# Altium schematic sheet 10. TF Card.SchDoc
size A4; CheckedBy: 黄钦宁; Author: 陈坤; DocumentNumber: 10; SheetNumber: 10; SheetTotal: 13; PageSetup: Record=PageOptions|CenterHorizontal=True|CenterVertical=True|PrintScale=1.00|XCorrection=1.00|YCorrection=1.00|PrintKind=0|BorderSize=5000000|LeftOffset=0|BottomOffset=0|Orientation=2|PaperLength=1000|PaperWidth=1000|Scale=100|PaperSource=7|PrintQuality=600|MediaType=1|DitherType=10|PaperKind=A4|PrintScaleMode=1; DesignDate: 2013-08-16; CheckDate: 2013-12-28; SheetName: TF Card; SheetVersion: V1.00; SheetDescription: TF卡接口; ModifiedDate1: 2013-11-30; ModifiedContent1: 将上拉电阻改为分立电阻，方便调试; ProductName: EasyARM-iMX28学习套件; ProductModel: EasyARM-iMX283
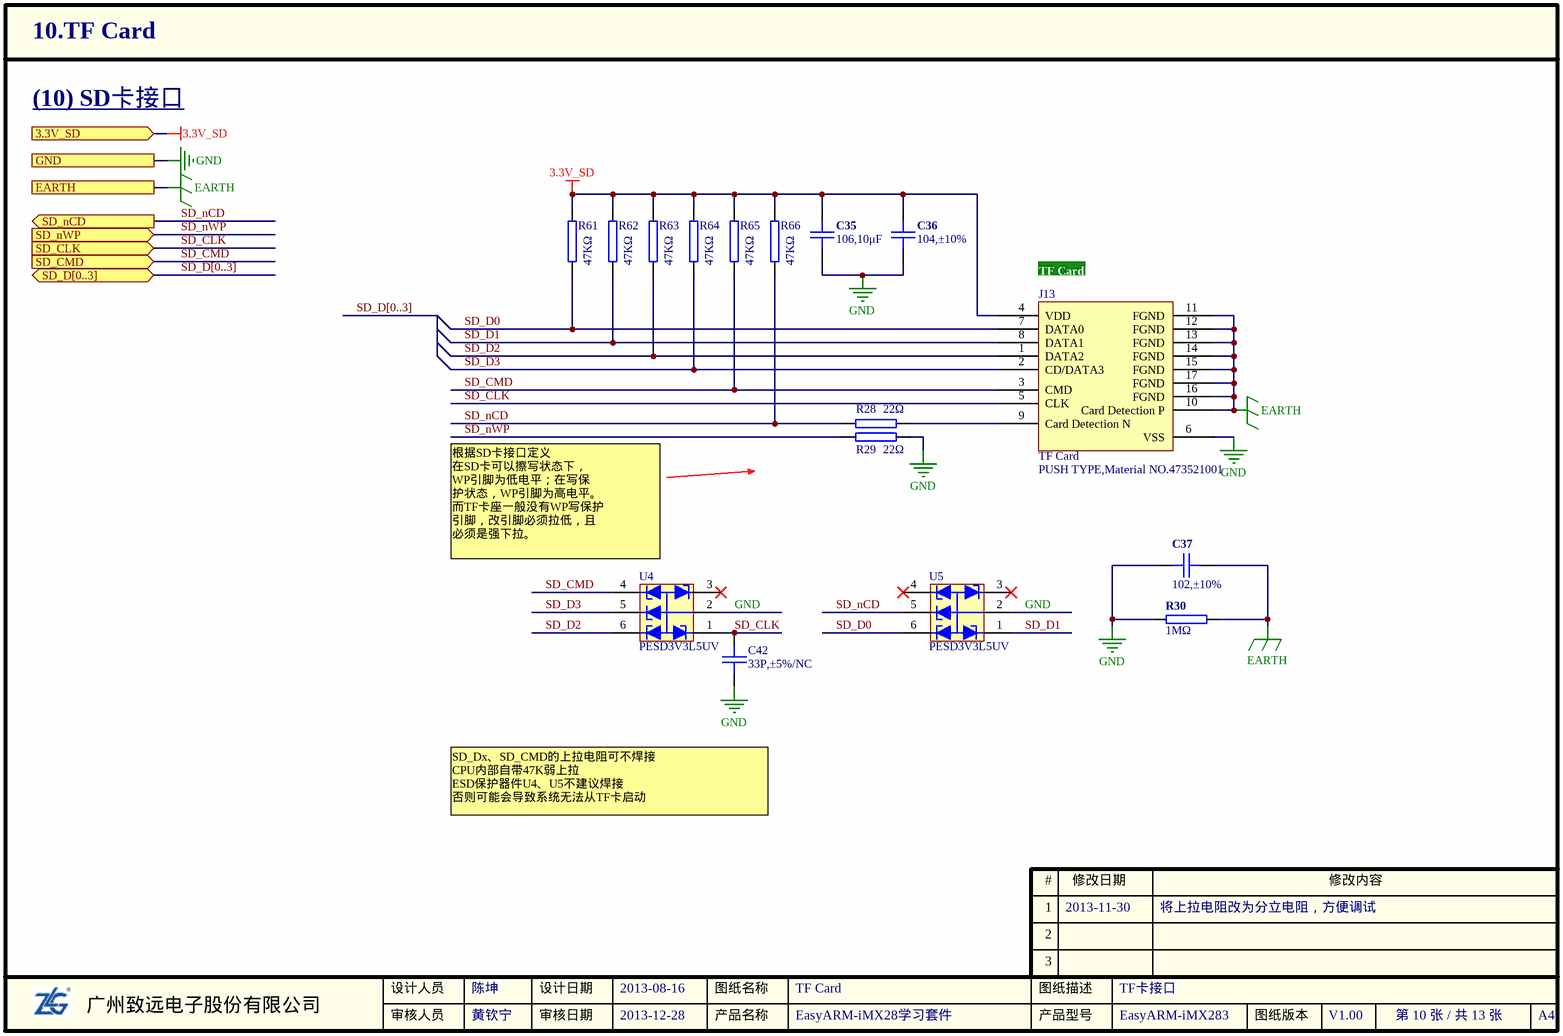
[diagram p0: 10. TF Card.SchDoc]

## Parts
C35  106,10μF  [0805C]
C36  104,±10%  [0603C]
C37  102,±10%  [1206C]
C42  33P,±5%/NC  [0603C]
J13  TF Card  value PUSH TYPE,Material NO.473521001  [TF-MOLEX_a]
R28  22Ω  [0603R]
R29  22Ω  [0603R]
R30  1MΩ  [1206R]
R61  47KΩ  [0603R]
R62  47KΩ  [0603R]
R63  47KΩ  [0603R]
R64  47KΩ  [0603R]
R65  47KΩ  [0603R]
R66  47KΩ  [0603R]
U4  value PESD3V3L5UV  [SOT-666]  (hidden comment: PESD5V0L5UV)
U5  value PESD3V3L5UV  [SOT-666]  (hidden comment: PESD5V0L5UV)

## Ports
3.3V_SD, EARTH, GND, SD_CLK (in), SD_CMD (in), SD_D[0..3] (bidir), SD_nCD (out), SD_nWP (in)

## Nets
3.3V_SD: C35.1 C36.1 J13.4(VDD) R61.2 R62.2 R63.2 R64.2 R65.2 R66.2 ; port 3.3V_SD
EARTH: C37.1 J13.10(Card_Detection_P) J13.11(FGND) J13.12(FGND) J13.13(FGND) J13.14(FGND) J13.15(FGND) J13.16(FGND) J13.17(FGND) R30.1 ; port EARTH
GND: C35.2 C36.2 C37.2 C42.2 J13.6(VSS) R29.1 R30.2 U4.2 U5.2 ; port GND
SD_CLK: C42.1 J13.5(CLK) U4.1 ; port SD_CLK
SD_CMD: J13.3(CMD) R65.1 U4.4 ; port SD_CMD
SD_D0: J13.7(DATA0) R61.1 U5.6
SD_D1: J13.8(DATA1) R62.1 U5.1
SD_D2: J13.1(DATA2) R63.1 U4.6
SD_D3: J13.2(CD/DATA3) R64.1 U4.5
SD_nCD: R28.1 R66.1 U5.5 ; port SD_nCD
SD_nWP: R29.2 ; port SD_nWP
NetJ13_9: J13.9(Card_Detection_N) R28.2

Not connected (* = marked no-connect by the designer): U4 3*; U5 3* 4*

## Buses and harness runs
bus SD_D[0..3]
bus SD_D[0..3] = port SD_D[0..3]

## Notes on the sheet
- (10) SD卡接口
- (near J13) TF Card
- (near U4) 根据SD卡接口定义
  在SD卡可以擦写状态下，
  WP引脚为低电平；在写保
  护状态，WP引脚为高电平。
  而TF卡座一般没有WP写保护
  引脚，改引脚必须拉低，且
  必须是强下拉。
- SD_Dx、SD_CMD的上拉电阻可不焊接
  CPU内部自带47K弱上拉
  ESD保护器件U4、U5不建议焊接
  否则可能会导致系统无法从TF卡启动
- 1
- #
- 修改日期
- 修改内容
- 2
- 3
- 广州致远电子股份有限公司
- 设计人员
- 审核人员
- 设计日期
- 审核日期
- 产品名称
- 图纸名称
- 产品型号
- 图纸描述
- 图纸版本
- A4

## Library data of the parts
C35 = 1.02.02.0055: 106,10μF,±10%,10V,X5R,0805,RoHS; 名称: 电容; 封装: 0805; 设备封装名称: C0805_106_X5R_10V_10%; 贴片和直插: SMT; 物料代码: 1.02.02.0055; Value: 106,10μF; RoHS: RoHS; 型号: 106,10μF,±10%,10V,X5R; ComponentLink1Description: ErpDataInfo; ComponentLink1URL: http://erp.zlgmcu.com/ErpExt/ErpData/ListMateriel.aspx?pkey=1.02.02.0055
C36 = 1.02.01.0032: 104,±10%,50V,X7R,0603,*,RoHS; 名称: 电容; 封装: 0603; 设备封装名称: C0603_104_X7R_50V_10%; 贴片和直插: SMT; 物料代码: 1.02.01.0032; Value: 104,±10%; RoHS: RoHS; 型号: 104,±10%,50V,X7R; ComponentLink1Description: ErpDataInfo; ComponentLink1URL: http://erp.zlgmcu.com/ErpExt/ErpData/ListMateriel.aspx?pkey=1.02.01.0032
C37 = 1.02.03.0003: Capacitor; 名称: 电容; 规格型号: 102,±10%,2KV,X7R,1206,*,RoHS; 现有库存: 26517; 封装: 1206; 设备封装名称: C1206_102_X7R_2KV_10%; 贴片和直插: SMT; 物料代码: 1.02.03.0003; Value: 102,±10%; ComponentLink1Description: ErpDataInfo; ComponentLink1URL: http://erp.zlgmcu.com/ErpExt/ErpData/ListMateriel.aspx?pkey=1.02.03.0003; RoHS: RoHS
C42 = 1.02.01.0045: 33P,±5%,50V,COG,0603,RoHS; 名称: 电容; 封装: 0603; 设备封装名称: C0603_33P_COG_50V_5%; 贴片和直插: SMT; 物料代码: 1.02.01.0045; Value: 33P,±5%/NC; RoHS: RoHS; 型号: 33P,±5%,50V,COG; ComponentLink1Description: ErpDataInfo; ComponentLink1URL: http://erp.zlgmcu.com/ErpExt/ErpData/ListMateriel.aspx?pkey=1.02.01.0045
J13 = 1.10.05.0147: PUSH TYPE,Material NO.473521001,15.2×14×1.88mm,molex,RoHS; 名称: TF卡座; 贴片和直插: SMT; 物料代码: 1.10.05.0147; 厂商: molex; RoHS: RoHS; 型号: PUSH TYPE,Material NO.473521001,15.2×14×1.88mm; ComponentLink1Description: ErpDataInfo; ComponentLink1URL: http://erp.zlgmcu.com/ErpExt/ErpData/ListMateriel.aspx?pkey=1.10.05.0147
R28 R29 = 1.01.01.0014: 名称: 电阻; 规格型号: 22Ω,0603,*,RoHS; 现有库存: 99098; 物料代码: 1.01.01.0014; Value: 22Ω; ComponentLink1Description: ErpDataInfo; ComponentLink1URL: http://192.168.0.2:8012/ErpExt/ErpData/ListMateriel.aspx?pkey=1.01.01.0014
R30 = 1.01.03.0019: 名称: 电阻; 规格型号: 1MΩ,1206,RoHS; 现有库存: 12252; 封装: 1206; 设备封装名称: R1206_1M; 贴片和直插: SMT; 物料代码: 1.01.03.0019; Value: 1MΩ; ComponentLink1Description: ErpDataInfo; ComponentLink1URL: http://erp.zlgmcu.com/ErpExt/ErpData/ListMateriel.aspx?pkey=1.01.03.0019; RoHS: RoHS
R61-R66 = 1.01.01.0060: 47KΩ,0603,*,RoHS; 名称: 电阻; 封装: 0603; 设备封装名称: R0603_47K; 贴片和直插: SMT; 物料代码: 1.01.01.0060; Value: 47KΩ; RoHS: RoHS; 型号: 47KΩ; ComponentLink1Description: ErpDataInfo; ComponentLink1URL: http://erp.zlgmcu.com/ErpExt/ErpData/ListMateriel.aspx?pkey=1.01.01.0060
U4 U5 = 1.05.10.0315: PESD3V3L5UV,SOT-666,NXP,RoHS; 名称: IC; 设备封装名称: SOT-666_PESD3V3L5UV; 贴片和直插: SMT; 物料代码: 1.05.10.0315; 封装: SOT-666; 厂商: NXP; RoHS: RoHS; 型号: PESD3V3L5UV; ComponentLink1Description: ErpDataInfo; ComponentLink1URL: http://erp.zlgmcu.com/ErpExt/ErpData/ListMateriel.aspx?pkey=1.05.10.0315